# Altium project IIS.PrjPcb (part 1 of 3)
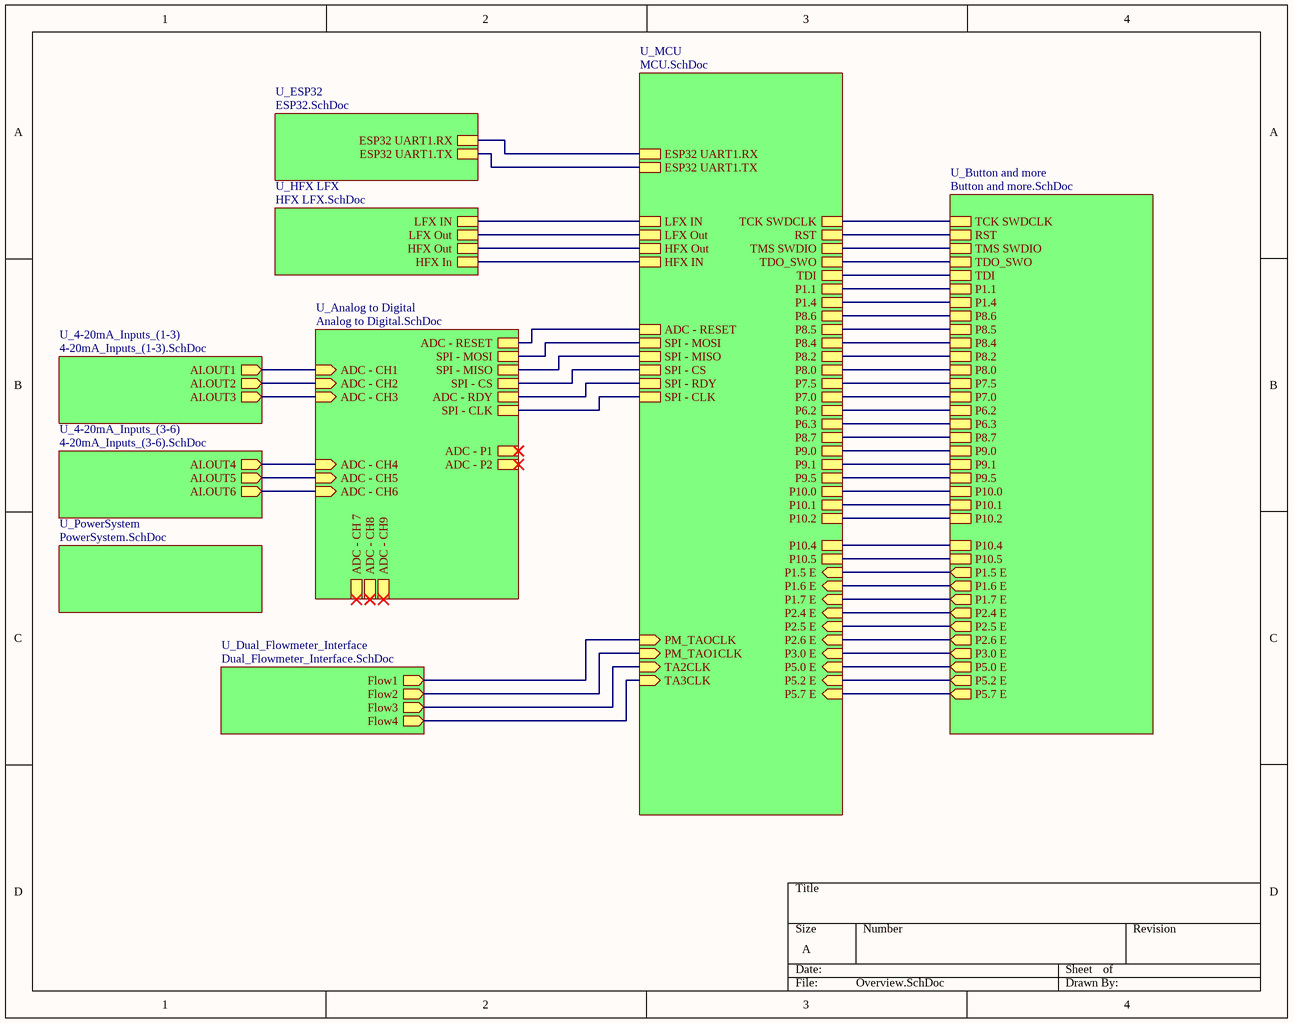
[diagram p0: Overview.SchDoc]
15 sheets, 216 parts. Net scope: hierarchical (ports join the sheet entries above them; power ports are global).
Board file: IIS_PCB.PcbDoc
Sheets:
  Overview.SchDoc
    U_MCU = MCU.SchDoc
    U_ESP32 = ESP32.SchDoc
    U_HFX LFX = HFX LFX.SchDoc
    U_Analog to Digital = Analog to Digital.SchDoc
    U_4-20mA_Inputs_(1-3) = 4-20mA_Inputs_(1-3).SchDoc
      U_4-20mA = 4-20mA.SchDoc
      U_4-20mA = 4-20mA.SchDoc
      U_4-20mA = 4-20mA.SchDoc
    U_4-20mA_Inputs_(3-6) = 4-20mA_Inputs_(3-6).SchDoc
      U_4-20mA = 4-20mA.SchDoc
      U_4-20mA = 4-20mA.SchDoc
      U_4-20mA = 4-20mA.SchDoc
    U_PowerSystem = PowerSystem.SchDoc
      U_5V_DCDC_Conv = 5V_DCDC_Conv.SchDoc
      U_3.3V_Regulator = 3.3V_Regulator.SchDoc
      U_24V_DCDC_Conv = 24V_DCDC_Conv.SchDoc
    U_Dual_Flowmeter_Interface = Dual_Flowmeter_Interface.SchDoc
      U_Dual_Flowmeter = Dual_Flowmeter.SchDoc
      U_Dual_Flowmeter = Dual_Flowmeter.SchDoc
    U_Button and more = Button and more.SchDoc

## Sheet Overview.SchDoc
size A; SheetNumber: 1; SheetTotal: 15

### Sub-sheets
U_4-20mA_Inputs_(1-3) = 4-20mA_Inputs_(1-3).SchDoc: AI.OUT1 (out), AI.OUT2 (out), AI.OUT3 (out)
U_4-20mA_Inputs_(3-6) = 4-20mA_Inputs_(3-6).SchDoc: AI.OUT4 (out), AI.OUT5 (out), AI.OUT6 (out)
U_Analog to Digital = Analog to Digital.SchDoc: ADC - RESET, SPI - MOSI, SPI - MISO, SPI - CS, ADC - CH1 (in), ADC - CH2 (in), ADC - CH3 (in), ADC - CH4 (in), ADC - CH5 (in), ADC - CH6 (in), ADC - CH 7, ADC - CH8, ADC - CH9, ADC - P1, ADC - P2, ADC - RDY, SPI - CLK
U_Button and more = Button and more.SchDoc: P10.5, P10.4, P10.2, P10.1, P10.0, P9.5, P9.1, P9.0, P8.7, P8.6, P8.5, P8.4, P8.2, P8.0, P7.5, P7.0, P6.2, P6.3, TDO_SWO, TDI, TCK SWDCLK, TMS SWDIO, RST, P1.4, P1.1, P1.5 E (out), P2.6 E (out), P2.4 E (out), P2.5 E (out), P3.0 E (out), P1.6 E (out), P1.7 E (out), P5.0 E (out), P5.2 E (out), P5.7 E (out)
U_Dual_Flowmeter_Interface = Dual_Flowmeter_Interface.SchDoc: Flow1 (out), Flow2 (out), Flow3 (out), Flow4 (out)
U_ESP32 = ESP32.SchDoc: ESP32 UART1.TX, ESP32 UART1.RX
U_HFX LFX = HFX LFX.SchDoc: HFX In, HFX Out, LFX Out, LFX IN
U_MCU = MCU.SchDoc: P1.1, TCK SWDCLK, HFX IN, LFX IN, P1.4, ESP32 UART1.RX, ESP32 UART1.TX, LFX Out, HFX Out, RST, TMS SWDIO, P10.5, P10.4, P10.2, P10.1, P10.0, P9.5, P9.1, P9.0, P8.7, P8.6, P8.5, P8.4, TA3CLK (in), P8.2, P8.0, P7.5, P7.0, TDO_SWO, P6.2, P6.3, TA2CLK (in), PM_TAOCLK (in), PM_TAO1CLK (in), P1.5 E (in), P2.6 E (in), P2.4 E (in), P2.5 E (in), P3.0 E (in), P5.7 E (in), P1.6 E (in), P1.7 E (in), P5.0 E (in), P5.2 E (in), TDI, SPI - CLK, SPI - MOSI, SPI - MISO, ADC - RESET, SPI - RDY, SPI - CS
U_PowerSystem = PowerSystem.SchDoc: no entries

### Nets
RST: sheet U_MCU/RST, sheet U_Button and more/RST
TMS_SWDIO: sheet U_MCU/TMS SWDIO, sheet U_Button and more/TMS SWDIO
NetCF3_U_4-20mA_Inputs_(1-3)_U_4-20mA#1_1: sheet U_Analog to Digital/ADC - CH1, sheet U_4-20mA_Inputs_(1-3)/AI.OUT1
NetCF3_U_4-20mA_Inputs_(1-3)_U_4-20mA#2_1: sheet U_Analog to Digital/ADC - CH2, sheet U_4-20mA_Inputs_(1-3)/AI.OUT2
NetCF3_U_4-20mA_Inputs_(1-3)_U_4-20mA#3_1: sheet U_Analog to Digital/ADC - CH3, sheet U_4-20mA_Inputs_(1-3)/AI.OUT3
NetCF3_U_4-20mA_Inputs_(3-6)_U_4-20mA#1_1: sheet U_Analog to Digital/ADC - CH4, sheet U_4-20mA_Inputs_(3-6)/AI.OUT4
NetCF3_U_4-20mA_Inputs_(3-6)_U_4-20mA#2_1: sheet U_Analog to Digital/ADC - CH5, sheet U_4-20mA_Inputs_(3-6)/AI.OUT5
NetCF3_U_4-20mA_Inputs_(3-6)_U_4-20mA#3_1: sheet U_Analog to Digital/ADC - CH6, sheet U_4-20mA_Inputs_(3-6)/AI.OUT6
NetCH1_2: sheet U_MCU/HFX Out, sheet U_HFX LFX/HFX Out
NetCH2_2: sheet U_MCU/HFX IN, sheet U_HFX LFX/HFX In
NetCL1_2: sheet U_MCU/LFX IN, sheet U_HFX LFX/LFX IN
NetCL2_2: sheet U_MCU/LFX Out, sheet U_HFX LFX/LFX Out
NetJEPD1_11: sheet U_MCU/P2.6 E, sheet U_Button and more/P2.6 E
NetJEPD1_13: sheet U_MCU/P3.0 E, sheet U_Button and more/P3.0 E
NetJEPD1_15: sheet U_MCU/P5.7 E, sheet U_Button and more/P5.7 E
NetJEPD1_17: sheet U_MCU/P5.2 E, sheet U_Button and more/P5.2 E
NetJEPD1_19: sheet U_MCU/P5.0 E, sheet U_Button and more/P5.0 E
NetJEPD1_23: sheet U_MCU/P2.4 E, sheet U_Button and more/P2.4 E
NetJEPD1_25: sheet U_MCU/P2.5 E, sheet U_Button and more/P2.5 E
NetJEPD1_29: sheet U_MCU/P1.6 E, sheet U_Button and more/P1.6 E
NetJEPD1_31: sheet U_MCU/P1.5 E, sheet U_Button and more/P1.5 E
NetJEPD1_33: sheet U_MCU/P1.7 E, sheet U_Button and more/P1.7 E
NetJEPD1_34: sheet U_MCU/TDI, sheet U_Button and more/TDI
NetJEPD1_36: sheet U_MCU/TDO_SWO, sheet U_Button and more/TDO_SWO
NetJEPD1_38: sheet U_MCU/TCK SWDCLK, sheet U_Button and more/TCK SWDCLK
NetR17_U_Dual_Flowmeter_Interface_U_Dual_Flowmeter#1_2: sheet U_MCU/TA2CLK, sheet U_Dual_Flowmeter_Interface/Flow3
NetR17_U_Dual_Flowmeter_Interface_U_Dual_Flowmeter#2_2: sheet U_MCU/PM_TAOCLK, sheet U_Dual_Flowmeter_Interface/Flow1
NetR27_U_Dual_Flowmeter_Interface_U_Dual_Flowmeter#1_1: sheet U_MCU/TA3CLK, sheet U_Dual_Flowmeter_Interface/Flow4
NetR27_U_Dual_Flowmeter_Interface_U_Dual_Flowmeter#2_1: sheet U_MCU/PM_TAO1CLK, sheet U_Dual_Flowmeter_Interface/Flow2
NetSW2_a: sheet U_MCU/P1.4, sheet U_Button and more/P1.4
NetSW3_a: sheet U_MCU/P1.1, sheet U_Button and more/P1.1
NetU1_1: sheet U_MCU/P10.1, sheet U_Button and more/P10.1
NetU1_2: sheet U_MCU/P10.2, sheet U_Button and more/P10.2
NetU1_17: sheet U_MCU/SPI - CLK, sheet U_Analog to Digital/SPI - CLK
NetU1_18: sheet U_MCU/SPI - MOSI, sheet U_Analog to Digital/SPI - MOSI
NetU1_19: sheet U_MCU/SPI - MISO, sheet U_Analog to Digital/SPI - MISO
NetU1_24: sheet U_MCU/P10.4, sheet U_Button and more/P10.4
NetU1_25: sheet U_MCU/P10.5, sheet U_Button and more/P10.5
NetU1_27: sheet U_MCU/P7.5, sheet U_Button and more/P7.5
NetU1_30: sheet U_MCU/P8.0, sheet U_Button and more/P8.0
NetU1_46: sheet U_MCU/P8.2, sheet U_Button and more/P8.2
NetU1_48: sheet U_MCU/P8.4, sheet U_Button and more/P8.4
NetU1_49: sheet U_MCU/P8.5, sheet U_Button and more/P8.5
NetU1_50: sheet U_MCU/P8.6, sheet U_Button and more/P8.6
NetU1_51: sheet U_MCU/P8.7, sheet U_Button and more/P8.7
NetU1_52: sheet U_MCU/P9.0, sheet U_Button and more/P9.0
NetU1_53: sheet U_MCU/P9.1, sheet U_Button and more/P9.1
NetU1_61: sheet U_MCU/SPI - RDY, sheet U_Analog to Digital/ADC - RDY
NetU1_62: sheet U_MCU/SPI - CS, sheet U_Analog to Digital/SPI - CS
NetU1_63: sheet U_MCU/ADC - RESET, sheet U_Analog to Digital/ADC - RESET
NetU1_76: sheet U_MCU/P6.2, sheet U_Button and more/P6.2
NetU1_77: sheet U_MCU/P6.3, sheet U_Button and more/P6.3
NetU1_88: sheet U_MCU/P7.0, sheet U_Button and more/P7.0
NetU1_97: sheet U_MCU/P9.5, sheet U_Button and more/P9.5
NetU1_98: sheet U_MCU/ESP32 UART1.RX, sheet U_ESP32/ESP32 UART1.RX
NetU1_99: sheet U_MCU/ESP32 UART1.TX, sheet U_ESP32/ESP32 UART1.TX
NetU1_100: sheet U_MCU/P10.0, sheet U_Button and more/P10.0

## Sheet MCU.SchDoc
size A; SheetNumber: 2; SheetTotal: 15
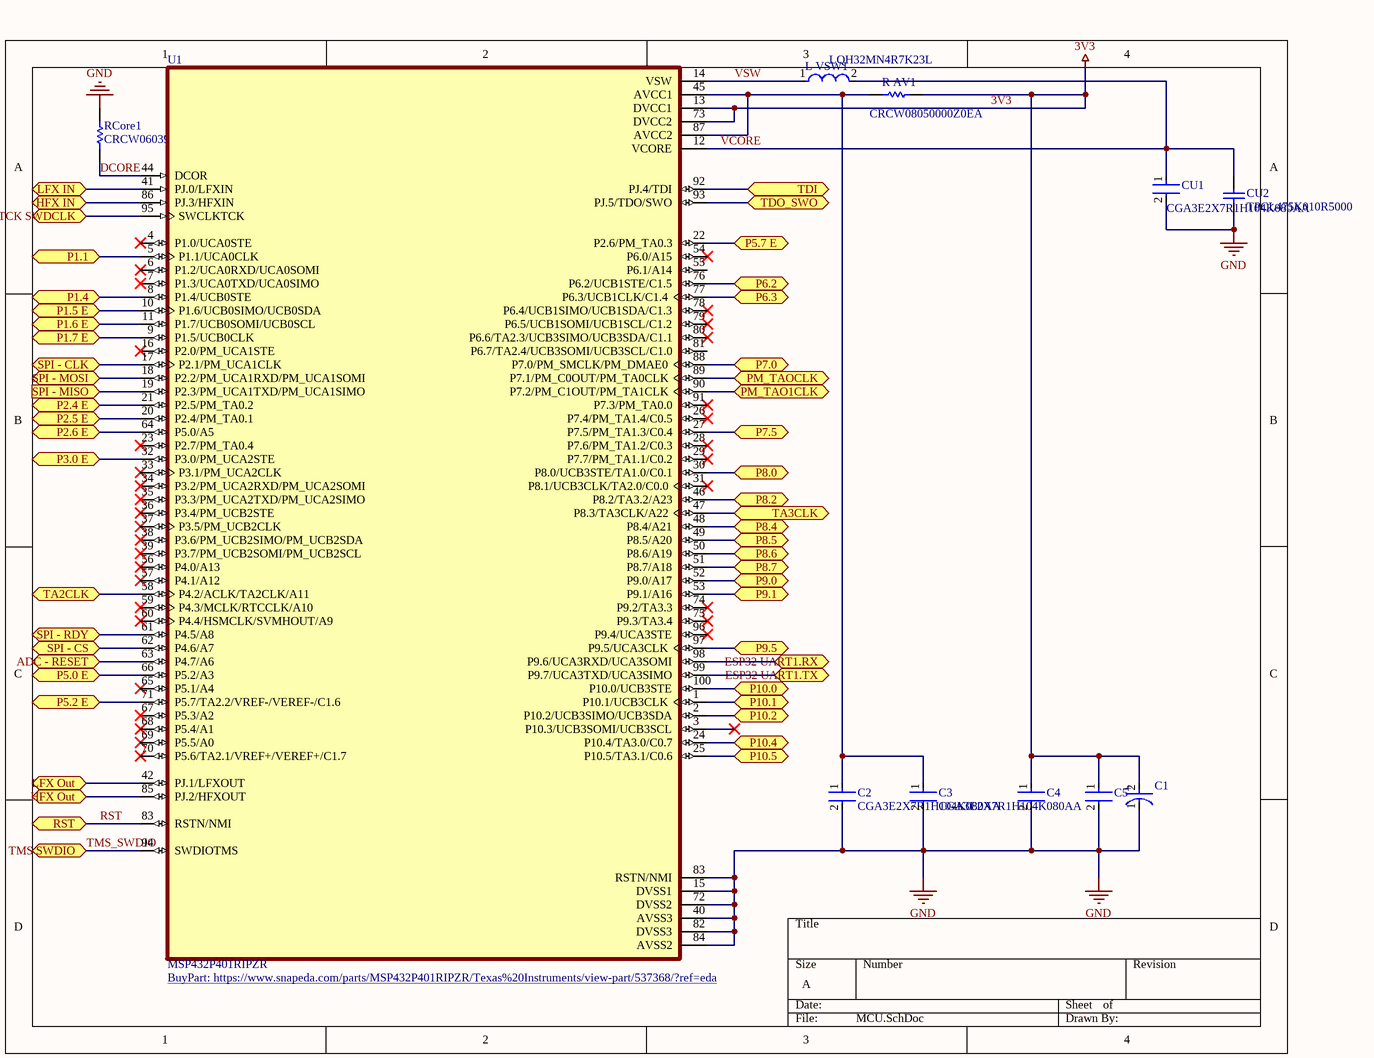
[diagram p1: MCU.SchDoc]

### Parts
C1  T520A106M010ATE080  [FP-T520A106M010ATE080-MFG]  (value not drawn)
C2  CGA3E2X7R1H104K080AA  [FP-CGA3E-0_3-0_1-IPC_A]
C3  CGA3E2X7R1H104K080AA  [FP-CGA3E-0_3-0_1-IPC_A]
C4  CGA3E2X7R1H104K080AA  [FP-CGA3E-0_3-0_1-IPC_A]  (value not drawn)
C5  CGA3E2X7R1H104K080AA  [FP-CGA3E-0_3-0_1-IPC_A]  (value not drawn)
CU1  CGA3E2X7R1H104K080AA  [FP-CGA3E-0_3-0_1-IPC_A]
CU2  TPCL475K010R5000  [CAPC1609X100X15LL20]
L_VSW1  LQH32MN4R7K23L  [FP-LQH32CH_23-MFG]
R_AV1  CRCW08050000Z0EA  [RESC2013X50X30LL20T20]
RCore1  CRCW060391K0FKEA  [RESC1609X50X30NL10T20]
U1  MSP432P401RIPZR  [QFP50P1600X1600X160-100N]

### Ports
ADC - RESET (bidir), ESP32 UART1.RX (bidir), ESP32 UART1.TX (bidir), HFX IN (bidir), HFX Out (bidir), LFX IN (bidir), LFX Out (bidir), P1.1 (bidir), P1.4 (bidir), P1.5 E (bidir), P1.6 E (bidir), P1.7 E (bidir), P2.4 E (bidir), P2.5 E (bidir), P2.6 E (bidir), P3.0 E (bidir), P5.0 E (bidir), P5.2 E (bidir), P5.7 E (bidir), P6.2 (bidir), P6.3 (bidir), P7.0 (bidir), P7.5 (bidir), P8.0 (bidir), P8.2 (bidir), P8.4 (bidir), P8.5 (bidir), P8.6 (bidir), P8.7 (bidir), P9.0 (bidir), P9.1 (bidir), P9.5 (bidir), P10.0 (bidir), P10.1 (bidir), P10.2 (bidir), P10.4 (bidir), P10.5 (bidir), PM_TAO1CLK (bidir), PM_TAOCLK (bidir), RST (bidir), SPI - CLK (bidir), SPI - CS (bidir), SPI - MISO (in), SPI - MOSI (bidir), SPI - RDY (bidir), TA2CLK (bidir), TA3CLK (bidir), TCK SWDCLK (bidir), TDI (bidir), TDO_SWO (bidir), TMS SWDIO (bidir)

### Nets
3V3: C1.2(A) C4.1 C5.1 R_AV1.2 U1.13(DVCC1) U1.73(DVCC2)
GND: C1.1(C) C2.2 C3.2 C4.2 C5.2 CU1.2 CU2.1 RCore1.1 U1.15(DVSS1) U1.40(AVSS3) U1.72(DVSS2) U1.82(DVSS3) U1.83(RSTN/NMI) U1.84(AVSS2)
\: U1.3(P10.3/UCB3SOMI/UCB3SCL)
DCORE: RCore1.2 U1.44(DCOR)
RST: U1.83(RSTN/NMI) ; port RST
TMS_SWDIO: U1.94(SWDIOTMS) ; port TMS SWDIO
VCORE: CU1.1 CU2.2 L_VSW1.2 U1.12(VCORE)
VSW: L_VSW1.1 U1.14(VSW)
NetC2_1: C2.1 C3.1 R_AV1.1 U1.45(AVCC1) U1.87(AVCC2)
NetCH1_2: U1.85(PJ.2/HFXOUT) ; port HFX Out
NetCH2_2: U1.86(PJ.3/HFXIN) ; port HFX IN
NetCL1_2: U1.41(PJ.0/LFXIN) ; port LFX IN
NetCL2_2: U1.42(PJ.1/LFXOUT) ; port LFX Out
NetJEPD1_11: U1.64(P5.0/A5) ; port P2.6 E
NetJEPD1_13: U1.32(P3.0/PM_UCA2STE) ; port P3.0 E
NetJEPD1_15: U1.22(P2.6/PM_TA0.3) ; port P5.7 E
NetJEPD1_17: U1.71(P5.7/TA2.2/VREF-/VEREF-/C1.6) ; port P5.2 E
NetJEPD1_19: U1.66(P5.2/A3) ; port P5.0 E
NetJEPD1_23: U1.21(P2.5/PM_TA0.2) ; port P2.4 E
NetJEPD1_25: U1.20(P2.4/PM_TA0.1) ; port P2.5 E
NetJEPD1_29: U1.11(P1.7/UCB0SOMI/UCB0SCL) ; port P1.6 E
NetJEPD1_31: U1.10(P1.6/UCB0SIMO/UCB0SDA) ; port P1.5 E
NetJEPD1_33: U1.9(P1.5/UCB0CLK) ; port P1.7 E
NetJEPD1_34: U1.92(PJ.4/TDI) ; port TDI
NetJEPD1_36: U1.93(PJ.5/TDO/SWO) ; port TDO_SWO
NetJEPD1_38: U1.95(SWCLKTCK) ; port TCK SWDCLK
NetR17_U_Dual_Flowmeter_Interface_U_Dual_Flowmeter#1_2: U1.58(P4.2/ACLK/TA2CLK/A11) ; port TA2CLK
NetR17_U_Dual_Flowmeter_Interface_U_Dual_Flowmeter#2_2: U1.89(P7.1/PM_C0OUT/PM_TA0CLK) ; port PM_TAOCLK
NetR27_U_Dual_Flowmeter_Interface_U_Dual_Flowmeter#1_1: U1.47(P8.3/TA3CLK/A22) ; port TA3CLK
NetR27_U_Dual_Flowmeter_Interface_U_Dual_Flowmeter#2_1: U1.90(P7.2/PM_C1OUT/PM_TA1CLK) ; port PM_TAO1CLK
NetSW2_a: U1.8(P1.4/UCB0STE) ; port P1.4
NetSW3_a: U1.5(P1.1/UCA0CLK) ; port P1.1
NetU1_1: U1.1(P10.1/UCB3CLK) ; port P10.1
NetU1_2: U1.2(P10.2/UCB3SIMO/UCB3SDA) ; port P10.2
NetU1_17: U1.17(P2.1/PM_UCA1CLK) ; port SPI - CLK
NetU1_18: U1.18(P2.2/PM_UCA1RXD/PM_UCA1SOMI) ; port SPI - MOSI
NetU1_19: U1.19(P2.3/PM_UCA1TXD/PM_UCA1SIMO) ; port SPI - MISO
NetU1_24: U1.24(P10.4/TA3.0/C0.7) ; port P10.4
NetU1_25: U1.25(P10.5/TA3.1/C0.6) ; port P10.5
NetU1_27: U1.27(P7.5/PM_TA1.3/C0.4) ; port P7.5
NetU1_30: U1.30(P8.0/UCB3STE/TA1.0/C0.1) ; port P8.0
NetU1_46: U1.46(P8.2/TA3.2/A23) ; port P8.2
NetU1_48: U1.48(P8.4/A21) ; port P8.4
NetU1_49: U1.49(P8.5/A20) ; port P8.5
NetU1_50: U1.50(P8.6/A19) ; port P8.6
NetU1_51: U1.51(P8.7/A18) ; port P8.7
NetU1_52: U1.52(P9.0/A17) ; port P9.0
NetU1_53: U1.53(P9.1/A16) ; port P9.1
NetU1_61: U1.61(P4.5/A8) ; port SPI - RDY
NetU1_62: U1.62(P4.6/A7) ; port SPI - CS
NetU1_63: U1.63(P4.7/A6) ; port ADC - RESET
NetU1_76: U1.76(P6.2/UCB1STE/C1.5) ; port P6.2
NetU1_77: U1.77(P6.3/UCB1CLK/C1.4) ; port P6.3
NetU1_88: U1.88(P7.0/PM_SMCLK/PM_DMAE0) ; port P7.0
NetU1_97: U1.97(P9.5/UCA3CLK) ; port P9.5
NetU1_98: U1.98(P9.6/UCA3RXD/UCA3SOMI) ; port ESP32 UART1.RX
NetU1_99: U1.99(P9.7/UCA3TXD/UCA3SIMO) ; port ESP32 UART1.TX
NetU1_100: U1.100(P10.0/UCB3STE) ; port P10.0

Not connected (* = marked no-connect by the designer): U1 4(P1.0/UCA0STE)* 6(P1.2/UCA0RXD/UCA0SOMI)* 7(P1.3/UCA0TXD/UCA0SIMO)* 16(P2.0/PM_UCA1STE)* 23(P2.7/PM_TA0.4)* 26(P7.4/PM_TA1.4/C0.5)* 28(P7.6/PM_TA1.2/C0.3)* 29(P7.7/PM_TA1.1/C0.2)* 31(P8.1/UCB3CLK/TA2.0/C0.0)* 33(P3.1/PM_UCA2CLK)* 34(P3.2/PM_UCA2RXD/PM_UCA2SOMI)* 35(P3.3/PM_UCA2TXD/PM_UCA2SIMO)* 36(P3.4/PM_UCB2STE)* 37(P3.5/PM_UCB2CLK)* 38(P3.6/PM_UCB2SIMO/PM_UCB2SDA)* 39(P3.7/PM_UCB2SOMI/PM_UCB2SCL)* 54(P6.0/A15)* 55(P6.1/A14) 56(P4.0/A13)* 57(P4.1/A12)* 59(P4.3/MCLK/RTCCLK/A10)* 60(P4.4/HSMCLK/SVMHOUT/A9)* 65(P5.1/A4)* 67(P5.3/A2)* 68(P5.4/A1)* 69(P5.5/A0)* 70(P5.6/TA2.1/VREF+/VEREF+/C1.7)* 74(P9.2/TA3.3)* 75(P9.3/TA3.4)* 78(P6.4/UCB1SIMO/UCB1SDA/C1.3)* 79(P6.5/UCB1SOMI/UCB1SCL/C1.2)* 80(P6.6/TA2.3/UCB3SIMO/UCB3SDA/C1.1)* 81(P6.7/TA2.4/UCB3SOMI/UCB3SCL/C1.0) 91(P7.3/PM_TA0.0)* 96(P9.4/UCA3STE)*

### Notes on the sheet
- (in symbol CMP-03017-000030-1) +

### Library data of the parts
C1 = CMP-03017-000030-1: CAP TANT POLY 10UF 10V 1206; Tolerance: 20%; Dielectric Material: Tantalum; Dissipation Factor: 8%; Leakage Current: 10uA; Life (Hours): 2000Hour; ESR (Equivalent Series Resistance): 80mR; Polarity: Polar; Length: 3.2mm; Construction: Flat; Features: General Purpose; Voltage Rating: 10V; Capacitance: 10uF; Width: 1.6mm; Mount: Surface Mount; Packaging: Tape and Reel; Voltage Rating (DC): 10V; Max Operating Temperature: 105°C; Case Code (Metric): 3216; Package Quantity: 1; Height: 1.6mm; Voltage: 10V; Depth: 1.6mm; Height - Seated (Max): 0.071inch; Radiation Hardening: No; Case/Package: 1206; Termination: SMD/SMT; Case Code (Imperial): 1206; Series: KO-CAP T520; REACH SVHC: No SVHC; RoHS Compliant: Yes; Min Operating Temperature: -55°C; Lead Free: Lead Free
C2-C5 CU1 = CMP-2000-07546-2: Cap Ceramic 100nF 50V X7R 10% Pad SMD 0603 +125°C Automotive T/R; Weight: 7.1E-05oz; Composition: Ceramic; Max Operating Temperature: 125°C; Termination: SMD/SMT; Dielectric: X7R; Length: 1.6mm; Package Quantity: 1; REACH SVHC: No SVHC; Lead Free: Lead Free; Case Code (Metric): 1608; Min Operating Temperature: -55°C; Packaging: Tape and Reel; Tolerance: 10%; Voltage Rating: 50V; Case Code (Imperial): 0603; Capacitance: 100nF; Case/Package: 0603; Voltage Rating (DC): 50V; Depth: 0.8mm; Radiation Hardening: No; Ratings: AEC-Q200; Mount: Surface Mount; Voltage: 50V; Thickness: 0.035inch; Width: 0.8mm; Height: 0.8mm
CU2 = CMP-2006-00210-1: Manufacturer: AVX Interconnect / Elco; Part Number: TPCL475K010R5000
L_VSW1 = CMP-06042-008286-2: Wire Wound Ferrite Inductor for General Circuits 4.7μH ±10% 1.2Ω 270mA 1210; Series Resistance: 1.2R; Test Frequency: 1MHz; Frequency: 31MHz; Shielding: Unshielded; Inductance: 4.7uH; Q Factor: 20; Case/Package: 1210; Min Operating Temperature: -25°C; Case Code (Metric): 3225; Height - Seated (Max): 0.087inch; Max DC Current: 270mA; Current Rating: 270mA; Case Code (Imperial): 1210; Tolerance: 10%; Length: 3.2mm; Width: 2.5mm; Number of Pins: 2; Weight: 0.000564oz; Packaging: Tape and Reel; Core Material: Ferrite; Height: 2mm; Termination: SMD/SMT; Self Resonant Frequency: 31MHz; DC Current: 270mA; Max Operating Temperature: 85°C; Radiation Hardening: No; Lead Free: Lead Free; Inductor Type: Wirewound; Rated Current-Max: 270mA; Mount: Surface Mount; Inductance Tolerance: 10%; Resistor Type: Wirewound; Military Standard: Not; Package Quantity: 1; REACH SVHC: No SVHC; Series: LQH32M; Depth: 2.7mm; DC Resistance (DCR): 1.2R
R_AV1 = CMP-2001-04896-1: Manufacturer: Vishay Dale; Part Number: CRCW08050000Z0EA
RCore1 = CMP-2000-03640-1: Manufacturer: Vishay Dale; Part Number: CRCW060391K0FKEA
U1 = MSP432P401RIPZR: SimpleLink ultra-low-power 32-bit Arm Cortex-M4F MCU With Precision ADC, 256KB Flash and 64KB RAM 100-LQFP -40 to 85; MF: Texas Instruments; Mouser-Purchase-URL: https://snapeda.com/shop?store=Mouser&id=537368; SnapEDA_Link: https://www.snapeda.com/parts/MSP432P401RIPZR/Texas%20Instruments/view-part/537368/?ref=snap; Digi-Key_Part_Number: 296-44715-1-ND; Texas_Instruments-Purchase-URL: https://snapeda.com/shop?store=Texas+Instruments&id=537368; Value: *; Package: LQFP-100 Texas Instruments; MP: MSP432P401RIPZR; DigiKey-Purchase-URL: https://snapeda.com/shop?store=DigiKey&id=537368; BuyPart: https://www.snapeda.com/parts/MSP432P401RIPZR/Texas%20Instruments/view-part/537368/?ref=eda

## Sheet ESP32.SchDoc
size A; SheetNumber: 5; SheetTotal: 16
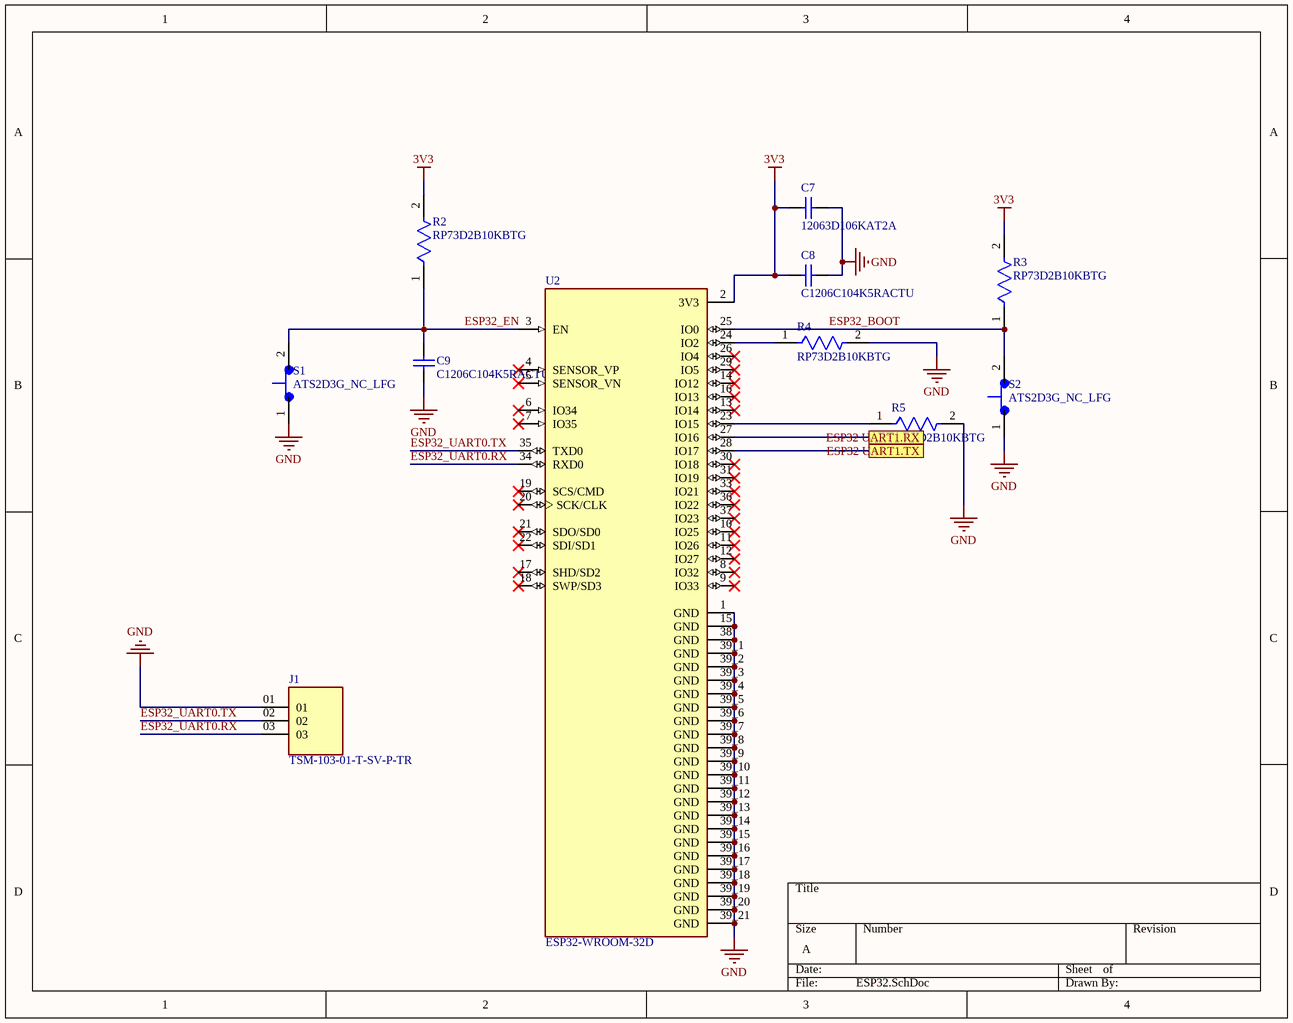
[diagram p2: ESP32.SchDoc]

### Parts
C7  12063D106KAT2A  [CAPC3216X229X50LL20T25]
C8  C1206C104K5RACTU  [KEMT-1206-2_M]
C9  C1206C104K5RACTU  [KEMT-1206-2_M]
J1  TSM-103-01-T-SV-P-TR  [SAMTEC_TSM-103-01-T-SV-P-TR]
R2  RP73D2B10KBTG  [FP-RP732B-MFG]
R3  RP73D2B10KBTG  [FP-RP732B-MFG]
R4  RP73D2B10KBTG  [FP-RP732B-MFG]
R5  RP73D2B10KBTG  [FP-RP732B-MFG]
S1  ATS2D3G_NC_LFG  [SW_ATS2D3G_NC_LFG]
S2  ATS2D3G_NC_LFG  [SW_ATS2D3G_NC_LFG]
U2  ESP32-WROOM-32D  [MODULE_ESP32-WROOM-32D]

### Ports
ESP32 UART1.RX, ESP32 UART1.TX

### Nets
3V3: C7.1 C8.1 R2.2 R3.2 U2.2(3V3)
GND: C7.2 C8.2 C9.1 J1.01 R4.2 R5.2 S1.1 S2.1 U2.1(GND) U2.15(GND) U2.38(GND) U2.39_1(GND) U2.39_2(GND) U2.39_3(GND) U2.39_4(GND) U2.39_5(GND) U2.39_6(GND) U2.39_7(GND) U2.39_8(GND) U2.39_9(GND) U2.39_10(GND) U2.39_11(GND) U2.39_12(GND) U2.39_13(GND) U2.39_14(GND) U2.39_15(GND) U2.39_16(GND) U2.39_17(GND) U2.39_18(GND) U2.39_19(GND) U2.39_20(GND) U2.39_21(GND)
ESP32_BOOT: R3.1 S2.2 U2.25(IO0)
ESP32_EN: C9.2 R2.1 S1.2 U2.3(EN)
ESP32_UART0.RX: J1.03 U2.34(RXD0)
ESP32_UART0.TX: J1.02 U2.35(TXD0)
NetR4_1: R4.1 U2.24(IO2)
NetR5_1: R5.1 U2.23(IO15)
NetU1_98: U2.27(IO16) ; port ESP32 UART1.RX
NetU1_99: U2.28(IO17) ; port ESP32 UART1.TX

Not connected (* = marked no-connect by the designer): U2 4(SENSOR_VP)* 5(SENSOR_VN)* 6(IO34)* 7(IO35)* 8(IO32)* 9(IO33)* 10(IO25)* 11(IO26)* 12(IO27)* 13(IO14)* 14(IO12)* 16(IO13)* 17(SHD/SD2)* 18(SWP/SD3)* 19(SCS/CMD)* 20(SCK/CLK)* 21(SDO/SD0)* 22(SDI/SD1)* 26(IO4)* 29(IO5)* 30(IO18)* 31(IO19)* 33(IO21)* 36(IO22)* 37(IO23)*

### Library data of the parts
C7 = CMP-2000-05863-1: Chip Capacitor, 10 uF, +/- 10%, 25 V, -55 to 85 degC, 1206 (3216 Metric), RoHS, Tape and Reel; Manufacturer: AVX; Rated Voltage: 25V; Dielectric: X5R; Capacitance: 10µF; Mounting Technology: SurfaceMount; Package Reference: 1206; Tolerance (%): ±10%; Manufacturer URL: http://www.avx.com/; Datasheet URL: http://datasheets.avx.com/cx5r.pdf; Package Description: 2-Pin Surface Mount Device, Body 3.2 x 1.6 mm; Datasheet Version: 05/2016; Case Size/Dimension: 1206
C8 C9 = CMP-1037-04202-2: CAP, Ceramic, 0.1 uF, +/- 10%, 50 V, -55 to 125 degC, 1206 (3216 Metric), RoHS, Tape and Reel; Manufacturer: Kemet; Voltage Rating: 50V; Capacitance: 0.1µF; Product Range: KEMET-CSeries; SVHC: ToBeAdvised; Dielectric Characteristic: X7R; Capacitor Case Style: 1206[3216Metric]; Package Reference: 1206-2; Package Description: 2-Leads SMD, Body 3.2 x 1.6 mm; Packaging: Tape&Reel; Operating Temperature Max: 125degC; Capacitance Tolerance: ±10%; Datasheet URL: https://datasheet.ciiva.com/6125/1725438-6125494.pdf; Manufacturer URL: http://www.kemet.com/; Operating Temperature Min: -55degC; Datasheet Version: Jul-13
J1 = TSM-103-01-T-SV-P-TR: MF: Samtec; Package: None; Availability: Unavailable; Value: *; MP: TSM-103-01-T-SV-P-TR; Price: None
R2-R5 = CMP-03211-008372-1: Res Thin Film 1206 10KΩ 0.1% 0.25W 15ppm/°C Molded SMD; Manufacturer: TE Connectivity; Voltage Rating: 200V; Temperature Range High: 155°C; packaging: 250 cut tape length; Composition: Thin Film; Category: Res; octopart_url: https://octopart.com/rp73d2b10kbtg-te+connectivity-42012630; ComponentLink2Description: Datasheet; Lead Free: Yes; Resistance: 10KΩ; Octopart: https://octopart.com/rp73d2b10kbtg-te+connectivity-42012630; Manufacturer Part Number: RP73D2B10KBTG; Temperature Coefficient: 15ppm/°C; Device Class L2: Resistors; Automotive: No; Ipc Land Pattern Name: RESC305155X55; Temperature: -55°C to 155°C; Device Class L1: Passive Components; Device Class L3: Chip SMD Resistors; Value: 10KΩ; Height: 0.65mm; Power Rating: 0.25W; Package: RP732B; Tolerance: 0.1%; Series: RP73; ComponentLink2URL: https://www.te.com/commerce/DocumentDelivery/DDEController?Action=showdoc&DocId=Data+Sheet%7F1773272%7FL%7Fpdf%7FEnglish%7FENG_DS_1773272_L.pdf%7F8-1879255-6; RoHS: TRUE; Temperature Range Low: -55°C
S1 S2 = ATS2D3G_NC_LFG: Tactile Switch SPST-NC Top Actuated Surface Mount; Package: None; Price: None; Value: *; MP: ATS2D3G_NC_LFG; Availability: Unavailable
U2 = ESP32-WROOM-32D: Bluetooth, WiFi 802.11b/g/n, Bluetooth v4.2 + EDR, Class 1, 2 and 3 Transceiver Module 2.4GHz ~ 2.5GHz Integrated, Trace Surface Mount; MF: Espressif Systems; Price: None; Package: Module Espressif Systems; Availability: Unavailable; SnapEDA_Link: https://www.snapeda.com/parts/ESP32-WROOM-32D/Espressif%20Systems/view-part/2768115/?ref=snap; Value: *; MP: ESP32-WROOM-32D

## Sheet HFX LFX.SchDoc
size A; SheetNumber: 4; SheetTotal: 15
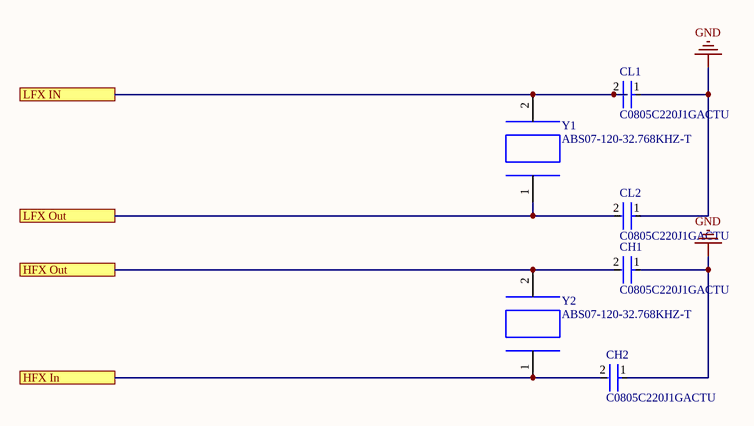
[diagram p3: HFX LFX.SchDoc]

### Parts
CH1  C0805C220J1GACTU  [FP-C0805C-DN-MFG]
CH2  C0805C220J1GACTU  [FP-C0805C-DN-MFG]
CL1  C0805C220J1GACTU  [FP-C0805C-DN-MFG]
CL2  C0805C220J1GACTU  [FP-C0805C-DN-MFG]
Y1  ABS07-120-32.768KHZ-T  [XTAL_ABS07-120-32.768KHZ-T]
Y2  ABS07-120-32.768KHZ-T  [XTAL_ABS07-120-32.768KHZ-T]

### Ports
HFX In, HFX Out, LFX IN, LFX Out

### Nets
GND: CH1.1 CH2.1 CL1.1 CL2.1
NetCH1_2: CH1.2 Y2.2 ; port HFX Out
NetCH2_2: CH2.2 Y2.1 ; port HFX In
NetCL1_2: CL1.2 Y1.2 ; port LFX IN
NetCL2_2: CL2.2 Y1.1 ; port LFX Out

### Library data of the parts
CH1 CH2 CL1 CL2 = CMP-2007-00448-2: CAP CER 22PF 100V 5% NP0 0805; Manufacturer: KEMET; Temperature Coefficient: 30ppm/°C; Tolerance: 0.05; Temperature Characteristic: C0G; Value: 22 pF; RoHS: TRUE; ComponentLink2URL: https://content.kemet.com/datasheets/KEM_C1003_C0G_SMD.pdf; Capacitance: 22 pF; Material: Ceramic; Mouser Description: Multilayer Ceramic Capacitor, C Series, 22 Pf, - 5%, C0g / Np0, 100 V, 0805 [2012 Metric] Rohs Compliant: Yes; Digikey Description: CAP CER 22PF 100V 5% NP0 0805; Octopart: https://octopart.com/c0805c220j1gactu-kemet-3791395; Device Class L3: Ceramic Capacitors; Device Class L2: Capacitors; Voltage Rating: 100 V; Temperature Range Low: -55°C; Ipc Land Pattern Name: CAPC200125X78; Lead Free: Yes; ComponentLink2Description: Datasheet; Manufacturer Part Number: C0805C220J1GACTU; Category: Cap; Temperature: -55°C to +125°C; Package: C0805C-DN; Device Class L1: Passive Components; Temperature Range High: +125°C; Height: 0.88mm; Automotive: No
Y1 Y2 = ABS07-120-32.768KHZ-T: 32.768kHz Â±20ppm Crystal 6pF 55 kOhms 2-SMD, No Lead; MF: Abracon; Value: *; SnapEDA_Link: https://www.snapeda.com/parts/ABS07-120-32.768KHZ-T/Abracon%20LLC/view-part/330478/?ref=snap; Package: SMD-2 Abracon LLC; MP: ABS07-120-32.768KHZ-T; Digi-Key_Purchase_URL: https://www.digikey.com/product-detail/en/abracon-llc/ABS07-120-32.768KHZ-T/535-11937-1-ND/3724046?utm_source=snapeda&utm_medium=aggregator&utm_campaign=symbol; Digi-Key_Part_Number: 535-11937-1-ND

## Sheet Analog to Digital.SchDoc
size A; SheetNumber: 6; SheetTotal: 15
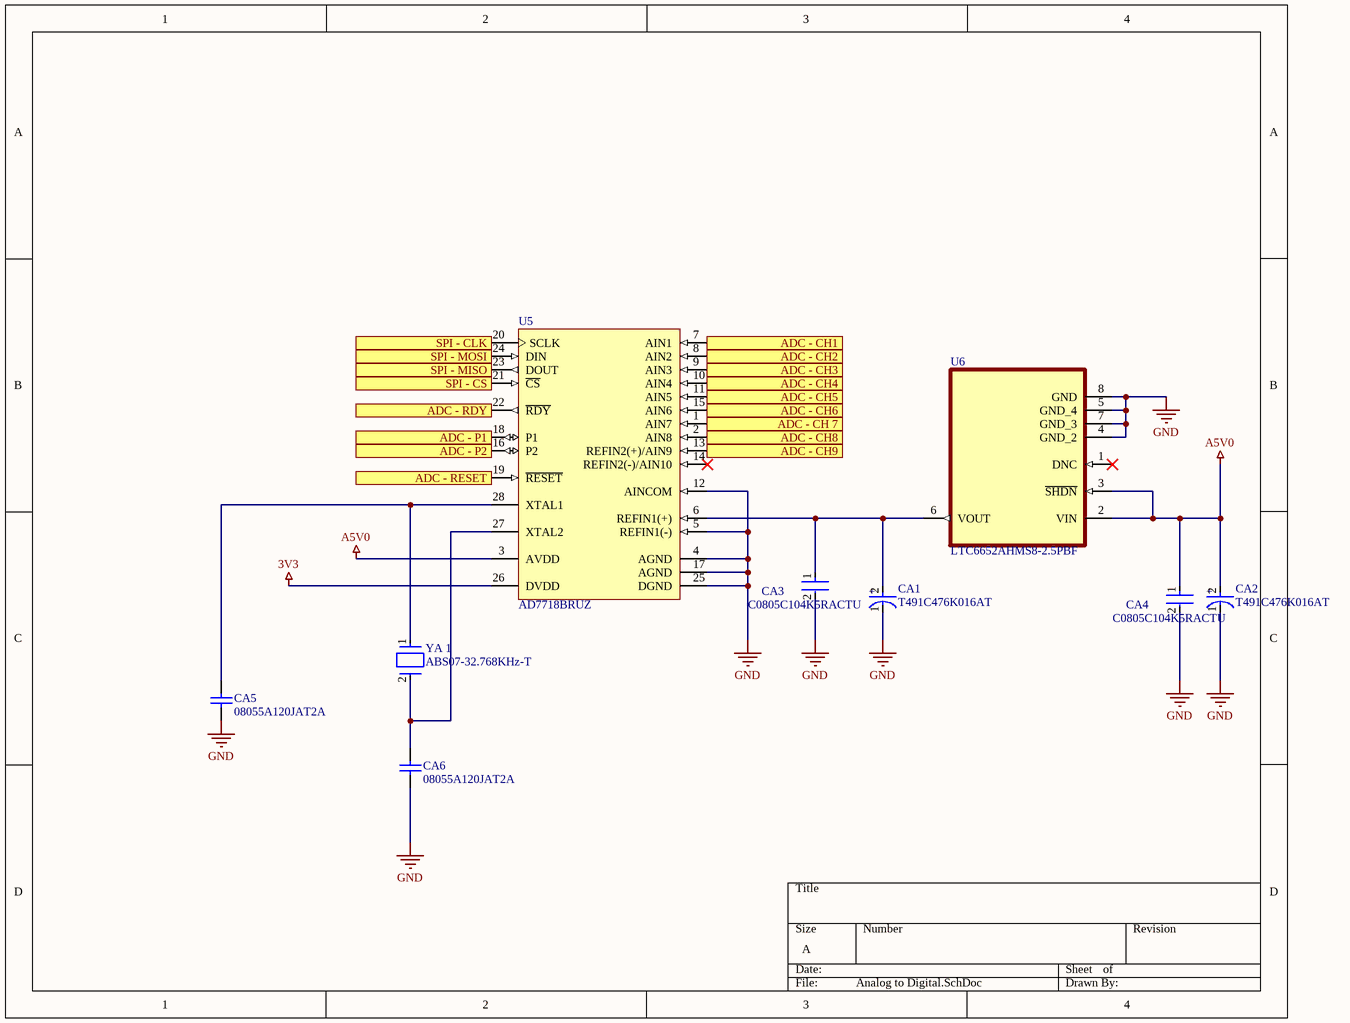
[diagram p4: Analog to Digital.SchDoc]

### Parts
CA1  T491C476K016AT  [FP-T491C476K016AT-MFG]
CA2  T491C476K016AT  [FP-T491C476K016AT-MFG]
CA3  C0805C104K5RACTU  [FP-C0805C-DN-MFG]
CA4  C0805C104K5RACTU  [FP-C0805C-DN-MFG]
CA5  08055A120JAT2A  [CAPC2013X71X50ML20T25]
CA6  08055A120JAT2A  [CAPC2013X71X50ML20T25]
U5  AD7718BRUZ  [RU-28_N]
U6  LTC6652AHMS8-2.5PBF  [SOP65P490X110-8N]
YA_1  ABS07-32.768KHz-T  [FP-ABS07-MFG]

### Ports
ADC - CH1 (in), ADC - CH2 (in), ADC - CH3 (in), ADC - CH4 (in), ADC - CH5 (in), ADC - CH6 (in), ADC - CH8 (in), ADC - CH9 (in), ADC - CH 7 (in), ADC - P1, ADC - P2, ADC - RDY, ADC - RESET, SPI - CLK, SPI - CS, SPI - MISO (out), SPI - MOSI (in)

### Nets
3V3: U5.26(DVDD)
A5V0: CA2.2(A) CA4.1 U5.3(AVDD) U6.2(VIN) U6.3(~{SHDN})
GND: CA1.1(C) CA2.1(C) CA3.2 CA4.2 CA5.1 CA6.1 U5.4(AGND) U5.5(REFIN1(-)) U5.12(AINCOM) U5.17(AGND) U5.25(DGND) U6.4(GND_2) U6.5(GND_4) U6.7(GND_3) U6.8(GND)
NetCA1_2: CA1.2(A) CA3.1 U5.6(REFIN1(+)) U6.6(VOUT)
NetCA5_2: CA5.2 U5.28(XTAL1) YA_1.1
NetCA6_2: CA6.2 U5.27(XTAL2) YA_1.2
NetCF3_U_4-20mA_Inputs_(1-3)_U_4-20mA#1_1: U5.7(AIN1) ; port ADC - CH1
NetCF3_U_4-20mA_Inputs_(1-3)_U_4-20mA#2_1: U5.8(AIN2) ; port ADC - CH2
NetCF3_U_4-20mA_Inputs_(1-3)_U_4-20mA#3_1: U5.9(AIN3) ; port ADC - CH3
NetCF3_U_4-20mA_Inputs_(3-6)_U_4-20mA#1_1: U5.10(AIN4) ; port ADC - CH4
NetCF3_U_4-20mA_Inputs_(3-6)_U_4-20mA#2_1: U5.11(AIN5) ; port ADC - CH5
NetCF3_U_4-20mA_Inputs_(3-6)_U_4-20mA#3_1: U5.15(AIN6) ; port ADC - CH6
NetU1_17: U5.20(SCLK) ; port SPI - CLK
NetU1_18: U5.24(DIN) ; port SPI - MOSI
NetU1_19: U5.23(DOUT) ; port SPI - MISO
NetU1_61: U5.22(~{RDY}) ; port ADC - RDY
NetU1_62: U5.21(~{CS}) ; port SPI - CS
NetU1_63: U5.19(~{RESET}) ; port ADC - RESET
NetU5_1: U5.1(AIN7) ; port ADC - CH 7
NetU5_2: U5.2(AIN8) ; port ADC - CH8
NetU5_13: U5.13(REFIN2(+)/AIN9) ; port ADC - CH9
NetU5_16: U5.16(P2) ; port ADC - P2
NetU5_18: U5.18(P1) ; port ADC - P1

Not connected (* = marked no-connect by the designer): U5 14(REFIN2(-)/AIN10)*; U6 1(DNC)*

### Notes on the sheet
- (in symbol CMP-03017-000042-1) +

### Library data of the parts
CA1 CA2 = CMP-03017-000042-1: CAP TANT 47UF 10% 16V 2312; Leakage Current: 7.5uA; Dielectric Material: Tantalum; Polarity: Polar; Dissipation Factor: 6%; Tolerance: 20%; ESR (Equivalent Series Resistance): 1.2R; Voltage: 6V; Ripple Current: 303mA; Life (Hours): 2000Hour; Min Operating Temperature: -55°C; Case/Package: Molded; Lead Free: Lead Free; Radiation Hardening: No; Voltage Rating: 16V; Failure Rate: 0.001%; Max Operating Temperature: 125°C; Features: General Purpose; Length: 6mm; REACH SVHC: No SVHC; Package Quantity: 1; Case Code (Metric): 6032; Mount: Surface Mount; Number of Pins: 2; Height: 2.5mm; Termination: SMD/SMT; RoHS Compliant: Yes; Width: 3.2mm; Case Code (Imperial): 2312; Voltage Rating (DC): 16V; Capacitance: 47uF; Depth: 3.2mm; Height - Seated (Max): 0.11inch; Packaging: Tape and Reel
CA3 CA4 = CMP-2007-00279-2: CAP CER 0.1UF 50V X7R 0805; Manufacturer: KEMET; Value: 0.10 μF; Tolerance: 0.1; Temperature Coefficient: 30ppm/°C; Manufacturer Part Number: C0805C104K5RACTU; Device Class L2: Capacitors; Temperature Range Low: -55°C; Voltage Rating: 50 V; Digikey Description: CAP CER 0.1UF 50V X7R 0805; Category: Cap; ComponentLink2Description: Datasheet; Octopart: https://octopart.com/c0805c104k5ractu-kemet-143926; RoHS: TRUE; ComponentLink2URL: https://content.kemet.com/datasheets/KEM_C1003_C0G_SMD.pdf; Temperature Characteristic: X7R; Temperature: -55°C to +125°C; Height: 0.88mm; Temperature Range High: +125°C; Device Class L1: Passive Components; Automotive: No; Lead Free: Yes; Ipc Land Pattern Name: CAPC200125X78; Material: Ceramic; Device Class L3: Ceramic Capacitors; Mouser Description: Cap Ceramic 0.1uF 50V X7R 10% SMD 2.0 x 1.2 mm 125 C Paper T/R; Capacitance: 0.10 μF; Package: C0805C-DN
CA5 CA6 = CMP-2007-04500-1: Manufacturer: AVX Interconnect / Elco; Part Number: 08055A120JAT2A
U5 = CMP-0313-02003-2: 10 Channel 24-Bit Low Power Sigma-Delta Analog-to-Digital Converter with Serial, SPI Interface, 1.365KSPS, -40 to +85 degC, RU-28, Pb-Free, Tube; Manufacturer: Analog Devices; Generic Part Number: AD7718; Interface: Ser, SPI; Resolution (Bits): 24; Channels: 10; Throughput Rate (SPS): 1.365K; PackageVersion: 2005; ComponentLink2URL: http://www.analog.com/static/imported-files/data_sheets/AD7708_7718.pdf; ComponentLink3Description: Package Specification; Packing: Tube; DatasheetVersion: Rev.0; Mounting Technology: Surface Mount; Code_JEDEC: MO-153-AE; ComponentLink3URL: http://www.analog.com/static/imported-files/packages/249854663RU_28.pdf; ComponentLink4Description: Product URL; ComponentLink1Description: Manufacturer URL; ComponentLink2Description: Datasheet; ComponentLink1URL: http://www.analog.com/en/index.html; ComponentLink4URL: http://www.analog.com/en/analog-to-digital-converters/ad-converters/ad7718/products/product.html; PackageReference: RU-28; PartNumber: AD7718BRUZ; RoHS: Y; PackageDescription: 28-Lead Thin Shrink Small Outline Package [TSSOP]
U6 = LTC6652AHMS8-2.5PBF: Ic Vref Series Prec 2.5v 8-Msop - Ltc6652ahms8-2.5#Pbf; MF: Linear Technology; Package: MSOP-8 Linear Technology; Price: None; Availability: Unavailable; MP: LTC6652AHMS8-2.5#PBF; SnapEDA_Link: https://www.snapeda.com/parts/LTC6652AHMS8-2.5%23PBF/Analog%20Devices/view-part/135303/?ref=snap; Value: *
YA_1 = CMP-0447-00001-3: CRYSTAL 32.7680KHZ 12.5PF SMD; Frequency Tolerance: 20ppm; Series Resistance: 70kR; Operating Frequency: 32.768 kHz; Number of Pins: 2; Package Quantity: 3000; Tolerance: 20ppm; Max Operating Temperature: 85°C; Width: 0.061inch; Frequency: 32.768kHz; Termination: SMD/SMT; Min Operating Temperature: -40°C; Radiation Hardening: No; Series: ABS07; Length: 3.2mm; Case/Package: CSMD; ESR (Equivalent Series Resistance): 70kR; RoHS Compliant: Yes; Load Capacitance: 12.5pF; Depth: 1.5mm; REACH SVHC: No SVHC; Height: 0.035inch; Packaging: Tape and Reel; Lead Free: Lead Free

## Sheet 4-20mA_Inputs_(1-3).SchDoc
size A; SheetNumber: 7; SheetTotal: 16
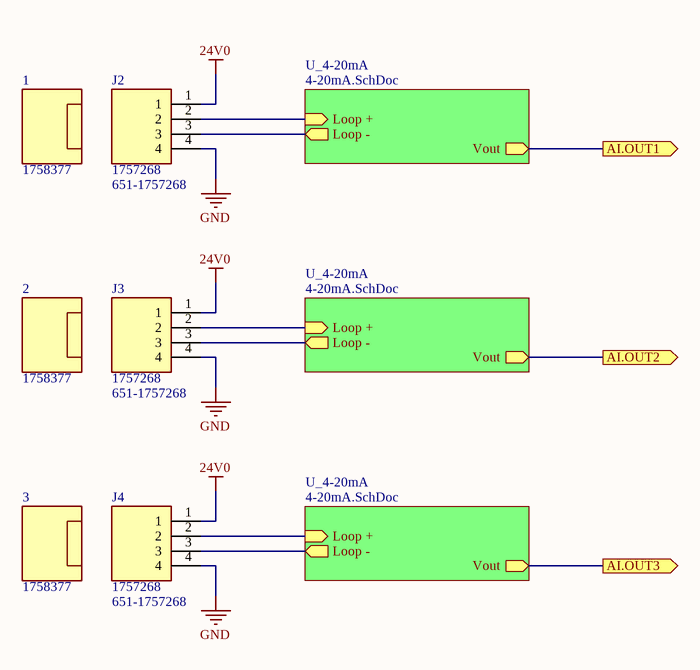
[diagram p5: 4-20mA_Inputs_(1-3).SchDoc]

### Parts
1  1758377  [Connector_1758377]
2  1758377  [Connector_1758377]
3  1758377  [Connector_1758377]
J2  1757268  Supplier Part Number 1: 651-1757268  [SHDRRA4W103P0X508_1X4_2232X1200X875P]
J3  1757268  Supplier Part Number 1: 651-1757268  [SHDRRA4W103P0X508_1X4_2232X1200X875P]
J4  1757268  Supplier Part Number 1: 651-1757268  [SHDRRA4W103P0X508_1X4_2232X1200X875P]

### Sub-sheets
U_4-20mA = 4-20mA.SchDoc: Loop + (in), Loop - (out), Vout (out)
U_4-20mA = 4-20mA.SchDoc: Loop + (in), Loop - (out), Vout (out)
U_4-20mA = 4-20mA.SchDoc: Loop + (in), Loop - (out), Vout (out)

### Ports
AI.OUT1 (out), AI.OUT2 (out), AI.OUT3 (out)

### Nets
24V0: J2.1 J3.1 J4.1
GND: J2.4 J3.4 J4.4
Net_U_1_U_4-20mA_Inputs_(1-3)_U_4-20mA#1_2: J2.3 ; sheet U_4-20mA/Loop -
Net_U_1_U_4-20mA_Inputs_(1-3)_U_4-20mA#2_2: J3.3 ; sheet U_4-20mA/Loop -
Net_U_1_U_4-20mA_Inputs_(1-3)_U_4-20mA#3_2: J4.3 ; sheet U_4-20mA/Loop -
NetCF3_U_4-20mA_Inputs_(1-3)_U_4-20mA#1_1: port AI.OUT1, sheet U_4-20mA/Vout
NetCF3_U_4-20mA_Inputs_(1-3)_U_4-20mA#2_1: port AI.OUT2, sheet U_4-20mA/Vout
NetCF3_U_4-20mA_Inputs_(1-3)_U_4-20mA#3_1: port AI.OUT3, sheet U_4-20mA/Vout
NetF1_U_4-20mA_Inputs_(1-3)_U_4-20mA#1_1: J2.2 ; sheet U_4-20mA/Loop +
NetF1_U_4-20mA_Inputs_(1-3)_U_4-20mA#2_1: J3.2 ; sheet U_4-20mA/Loop +
NetF1_U_4-20mA_Inputs_(1-3)_U_4-20mA#3_1: J4.2 ; sheet U_4-20mA/Loop +

### Library data of the parts
1-3 = 1758377: Plug, Terminal Block; 12 A; 250 V; 5.08 mm; 4 position, screw, Pre-Printed; Manufacturer: Phoenix Contact; Voltage Rating: 250V; Max Current Rating: 12A; Number of Positions Per Level: 4; Number of Levels: 1; Current: 15A; Voltage: 300V; Wire Gauge (Max): 30AWG; Wire Gauge (Min): 12AWG; Pitch: 5.08mm; Stripping Length: 7mm; Supplier 1: Digi-Key; Manufacturer Part Number: 1758377; RoHS: Yes; Category: Terminal Blocks; Pricing 1: 1=4.53000, 10=4.33400, 50=4.21580, 100=3.94000, 250=3.62484, 500=3.34900, 1000=3.19143, 2500=3.03380 (USD); Mount: Free Hanging; Color: Green; Contact Plating: Tin; Weight: 0.249387oz; Housing Color: Green; Housing Material: Plastic; Package Quantity: 50; Packaging: Bulk; Current Rating: 12A; Termination: Screw; Number of Positions: 4; Number of Contacts: 4; Number of Poles: 4; Connector Type: Screw; Series: COMBICON MSTB; Flammability Rating: UL94 V-0; ComponentLink1URL: https://datasheet.ciiva.com/795/1758377-795513.pdf?src-supplier=Digi-Key; ComponentLink1Description: https://datasheet.ciiva.com/795/1758377-795513.pdf?src-supplier=Digi-Key; ComponentLink2URL: https://datasheet.ciiva.com/16046/1758377-16046392.pdf?src-supplier=Onlinecomponents.com; ComponentLink2Description: https://datasheet.ciiva.com/16046/1758377-16046392.pdf?src-supplier=Onlinecomponents.com; ComponentLink3URL: https://datasheet.ciiva.com/29376/567557-da-01-de-steckerteil-1758377-50-st-29376878.pdf?src-supplier=Conrad; ComponentLink3Description: https://datasheet.ciiva.com/29376/567557-da-01-de-steckerteil-1758377-50-st-29376878.pdf?src-supplier=Conrad; ComponentLink4URL: https://datasheet.ciiva.com/14607/70055302-14607548.pdf?src-supplier=Allied+Electronics; ComponentLink4Description: https://datasheet.ciiva.com/14607/70055302-14607548.pdf?src-supplier=Allied+Electronics; ComponentLink5URL: https://datasheet.ciiva.com/33106/1758377-33106027.pdf?src-supplier=Today+Components; ComponentLink5Description: https://datasheet.ciiva.com/33106/1758377-33106027.pdf?src-supplier=Today+Components; Supplier Part Number 1: 277-1966-ND; Stock 1: 560
J2-J4 = 1757268: Connector; Manufacturer_Name: Phoenix Contact; Datasheet Link: https://datasheet.datasheetarchive.com/originals/distributors/SFDatasheet-2/sf-00051651.pdf; Height: 8.75mm; Manufacturer_Part_Number: 1757268; Mouser Part Number: 651-1757268; Mouser Price/Stock: https://www.mouser.co.uk/ProductDetail/Phoenix-Contact/1757268?qs=uD%2FdkN7XIa2BicmSj3mD7g%3D%3D; Arrow Part Number: 1757268; Arrow Price/Stock: https://www.arrow.com/en/products/1757268/phoenix-contact?region=nac; Supplier 1: Mouser

## Sheet 4-20mA.SchDoc
size A; SheetNumber: 8; SheetTotal: 15
Used 6 times, as channels U_4-20mA_Inputs_(1-3)/U_4-20mA, U_4-20mA_Inputs_(1-3)/U_4-20mA, U_4-20mA_Inputs_(1-3)/U_4-20mA, U_4-20mA_Inputs_(3-6)/U_4-20mA, U_4-20mA_Inputs_(3-6)/U_4-20mA, U_4-20mA_Inputs_(3-6)/U_4-20mA. Parts and nets are listed once, with the designators drawn on the sheet.
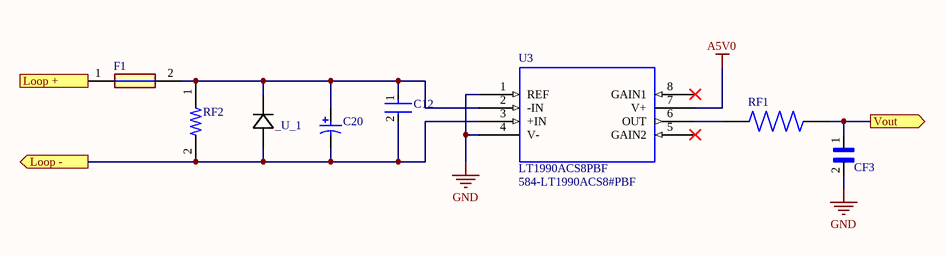
[diagram p6: 4-20mA.SchDoc]

### Parts
_U_1  1KSMB39CA  [1KSMBSeries_LTF]  (value not drawn)
C12  C0603C104K5RACTU  [FP-C0603C-CF-IPC_A]  (value not drawn)
C20  UUD1V4R7MCL1GS  [NIC-CAPA2-4X5.8_V]  (value not drawn)
CF3  GCM188R71C105KA64J  [CAPC1608X90N]  (value not drawn)
F1  0ZCJ0005FF2E  [FUSC3216X85N]  (value not drawn)
RF1  CRS2010AFX-1001ELF  [RESC5025X70N]  (value not drawn)
RF2  CRGS0805J100R  [RESC2012X65N]  (value not drawn)
U3  LT1990ACS8PBF  Supplier Part Number 1: 584-LT1990ACS8#PBF  [SO-8_S]

### Ports
Loop + (in), Loop - (out), Vout (out)

### Nets
A5V0: U3.7(V+)
GND: CF3.2 U3.1(REF) U3.4(V-)
Loop +: F1.1 ; port Loop +
Loop -: _U_1.2 C12.2 C20.2 RF2.2 U3.3(+IN) ; port Loop -
Vout: CF3.1 RF1.2 ; port Vout
Net_U_1_1: _U_1.1 C12.1 C20.1 F1.2 RF2.1 U3.2(-IN)
NetRF1_1: RF1.1 U3.6(OUT)

Not connected (* = marked no-connect by the designer): U3 5(GAIN2)* 8(GAIN1)*

### Channels
U_4-20mA_Inputs_(1-3)/U_4-20mA: designators end in _U_4-20mA_Inputs_(1-3)_U_4-20mA#1; ports Loop +=NetF1_U_4-20mA_Inputs_(1-3)_U_4-20mA#1_1 Loop -=Net_U_1_U_4-20mA_Inputs_(1-3)_U_4-20mA#1_2 Vout=NetCF3_U_4-20mA_Inputs_(1-3)_U_4-20mA#1_1
U_4-20mA_Inputs_(1-3)/U_4-20mA: designators end in _U_4-20mA_Inputs_(1-3)_U_4-20mA#2; ports Loop +=NetF1_U_4-20mA_Inputs_(1-3)_U_4-20mA#2_1 Loop -=Net_U_1_U_4-20mA_Inputs_(1-3)_U_4-20mA#2_2 Vout=NetCF3_U_4-20mA_Inputs_(1-3)_U_4-20mA#2_1
U_4-20mA_Inputs_(1-3)/U_4-20mA: designators end in _U_4-20mA_Inputs_(1-3)_U_4-20mA#3; ports Loop +=NetF1_U_4-20mA_Inputs_(1-3)_U_4-20mA#3_1 Loop -=Net_U_1_U_4-20mA_Inputs_(1-3)_U_4-20mA#3_2 Vout=NetCF3_U_4-20mA_Inputs_(1-3)_U_4-20mA#3_1
U_4-20mA_Inputs_(3-6)/U_4-20mA: designators end in _U_4-20mA_Inputs_(3-6)_U_4-20mA#1; ports Loop +=NetF1_U_4-20mA_Inputs_(3-6)_U_4-20mA#1_1 Loop -=Net_U_1_U_4-20mA_Inputs_(3-6)_U_4-20mA#1_2 Vout=NetCF3_U_4-20mA_Inputs_(3-6)_U_4-20mA#1_1
U_4-20mA_Inputs_(3-6)/U_4-20mA: designators end in _U_4-20mA_Inputs_(3-6)_U_4-20mA#2; ports Loop +=NetF1_U_4-20mA_Inputs_(3-6)_U_4-20mA#2_1 Loop -=Net_U_1_U_4-20mA_Inputs_(3-6)_U_4-20mA#2_2 Vout=NetCF3_U_4-20mA_Inputs_(3-6)_U_4-20mA#2_1
U_4-20mA_Inputs_(3-6)/U_4-20mA: designators end in _U_4-20mA_Inputs_(3-6)_U_4-20mA#3; ports Loop +=NetF1_U_4-20mA_Inputs_(3-6)_U_4-20mA#3_1 Loop -=Net_U_1_U_4-20mA_Inputs_(3-6)_U_4-20mA#3_2 Vout=NetCF3_U_4-20mA_Inputs_(3-6)_U_4-20mA#3_1

### Library data of the parts
_U_1 = 1KSMB39CA: No Description Available; Mfr_Name: Littelfuse Inc; Copyright: Copyright (C) 2021 Ultra Librarian. All rights reserved.; Manufacturer_Part_Number: 1KSMB39CA; Digi-Key_Part_Number_1: 1KSMB39CA-ND; Digi-Key_Part_Number_2: F11451CT-ND; Digi-Key_Part_Number_3: F11451DKR-ND; Digi-Key_Part_Number_4: F11451TR-ND; RefDes: RefDes; Type: DEV; Supplier 1: Digi-Key; Supplier Part Number 1: F11451CT-ND
C12 = C0603C104K5RACTU: Multilayer Ceramic Capacitors (MLCC) - SMD/SMT 50volts 0.1uF X7R 10%; Manufacturer: KEMET; Voltage Rating (DC): 50V; Capacitance: 100nF; Dissipation Factor: 2.5%; Supplier 1: Digi-Key; Manufacturer Part Number: C0603C104K5RACTU; RoHS: Yes; Category: Ceramic Capacitors; Pricing 1: 1=0.12000, 10=0.08500, 50=0.04620, 100=0.03770, 500=0.02696, 1000=0.02118 (USD); Mount: Surface Mount; Case/Package: 0603; Number of Pins: 2; Case Code (Metric): 1608; Case Code (Imperial): 0603; Dielectric Material: Ceramic; Contact Plating: Tin,Matte; Min Operating Temperature: -55°C; Max Operating Temperature: 125°C; Tolerance: 10%; Voltage Rating: 50V; Packaging: Tape and Reel; Package Quantity: 1; Dielectric: X7R; Termination: SMD/SMT; Voltage: 50V; Series: SMD Comm X7R; Length: 0.063inch; Width: 0.031inch; Height: 0.8mm; Thickness: 0.034inch; Depth: 0.8mm; Lead Pitch: 0.7mm; Radiation Hardening: No; REACH SVHC: No SVHC; RoHS Compliant: Yes; ComponentLink1URL: https://datasheet.ciiva.com/7823/kem-c1002-x7r-smd-7823591.pdf?src-supplier=Element14; ComponentLink1Description: https://datasheet.ciiva.com/7823/kem-c1002-x7r-smd-7823591.pdf?src-supplier=Element14; ComponentLink2URL: https://datasheet.ciiva.com/7823/kem-c1002-x7r-smd-7823592.pdf?src-supplier=Element14; ComponentLink2Description: https://datasheet.ciiva.com/7823/kem-c1002-x7r-smd-7823592.pdf?src-supplier=Element14; ComponentLink3URL: https://datasheet.ciiva.com/5999/kem-c1002-x7r-smd-5999400.pdf?src-supplier=Farnell; ComponentLink3Description: https://datasheet.ciiva.com/5999/kem-c1002-x7r-smd-5999400.pdf?src-supplier=Farnell; ComponentLink4URL: https://datasheet.ciiva.com/28645/1851736-28645640.pdf?src-supplier=Element14; ComponentLink4Description: https://datasheet.ciiva.com/28645/1851736-28645640.pdf?src-supplier=Element14; ComponentLink5URL: https://datasheet.ciiva.com/14585/70095383-14585209.pdf?src-supplier=Allied+Electronics; ComponentLink5Description: https://datasheet.ciiva.com/14585/70095383-14585209.pdf?src-supplier=Allied+Electronics; ComponentLink6URL: https://datasheet.ciiva.com/14602/70095383-14602583.pdf?src-supplier=Allied+Electronics; ComponentLink6Description: https://datasheet.ciiva.com/14602/70095383-14602583.pdf?src-supplier=Allied+Electronics; Supplier Part Number 1: 399-C0603C104K5RAC7867CT-ND; Stock 1: 10133409
C20 = UUD1V4R7MCL1GS: Cap Aluminum Lytic 4.7uF 35V 20% (4 X 5.8mm) SMD 80mA 2000h 105C Automotive T/R; Manufacturer: Nichicon; Dielectric Material: Aluminium; Leakage Current: 3uA; Life (Hours): 2000Hour; Impedance: 1.8R; Dissipation Factor: 0.12%; Supplier 1: Digi-Key; Manufacturer Part Number: UUD1V4R7MCL1GS; RoHS: Yes; Category: Aluminum Electrolytic Capacitors; Pricing 1: 1=0.51000, 10=0.35600, 50=0.24960, 100=0.21390, 500=0.16042, 1000=0.13547 (USD); Case/Package: Radial; Number of Pins: 2; Min Operating Temperature: -55°C; Max Operating Temperature: 105°C; Tolerance: 20%; Ripple Current: 80mA; Package Quantity: 2000; Voltage Rating (DC): 35V; Packaging: Tape and Reel; Capacitance: 4.7uF; Termination: SMD/SMT; Series: UUD; Voltage Rating: 35V; Construction: Cylindrical; Ripple Current (AC): 80mA; Diameter: 4mm; Length: 5.8mm; Height: 5.8mm; Height - Seated (Max): 0.228inch; Radiation Hardening: No; RoHS Compliant: Yes; Lead Free: Lead Free; REACH SVHC: No SVHC; ComponentLink1URL: https://datasheet.ciiva.com/96/e-ud-96647.pdf?src-supplier=Digi-Key; ComponentLink1Description: https://datasheet.ciiva.com/96/e-ud-96647.pdf?src-supplier=Digi-Key; ComponentLink2URL: https://datasheet.ciiva.com/96/e-ud-96648.pdf?src-supplier=Digi-Key; ComponentLink2Description: https://datasheet.ciiva.com/96/e-ud-96648.pdf?src-supplier=Digi-Key; ComponentLink3URL: https://datasheet.ciiva.com/96/e-ud-96649.pdf?src-supplier=Digi-Key; ComponentLink3Description: https://datasheet.ciiva.com/96/e-ud-96649.pdf?src-supplier=Digi-Key; ComponentLink4URL: https://datasheet.ciiva.com/5360/e-ud-5360520.pdf?src-supplier=Mouser; ComponentLink4Description: https://datasheet.ciiva.com/5360/e-ud-5360520.pdf?src-supplier=Mouser; ComponentLink5URL: https://datasheet.ciiva.com/11687/e-ud-11687388.pdf?src-supplier=Avnet; ComponentLink5Description: https://datasheet.ciiva.com/11687/e-ud-11687388.pdf?src-supplier=Avnet; ComponentLink6URL: https://datasheet.ciiva.com/16383/e-ud-16383407.pdf?src-supplier=Future+Electronics; ComponentLink6Description: https://datasheet.ciiva.com/16383/e-ud-16383407.pdf?src-supplier=Future+Electronics; ComponentLink7URL: https://datasheet.ciiva.com/7793/e-ud-7793429.pdf?src-supplier=Element14; ComponentLink7Description: https://datasheet.ciiva.com/7793/e-ud-7793429.pdf?src-supplier=Element14; ComponentLink8URL: https://datasheet.ciiva.com/17354/e-ud-17354680.pdf?src-supplier=Avnet+Europe; ComponentLink8Description: https://datasheet.ciiva.com/17354/e-ud-17354680.pdf?src-supplier=Avnet+Europe; Supplier Part Number 1: 493-2281-1-ND; Stock 1: 5341
CF3 = GCM188R71C105KA64J: 0603 1 uF 16 V Â±10% Tolerance X7R Automotive Multilayer Ceramic Capacitor; MF: Murata; Value: *; Price: None; Package: 1608 Murata; Check_prices: https://www.snapeda.com/parts/GCM188R71C105KA64J/Murata%20Electronics%20North%20America/view-part/1755583/?ref=eda; Availability: In Stock; SnapEDA_Link: https://www.snapeda.com/parts/GCM188R71C105KA64J/Murata%20Electronics%20North%20America/view-part/1755583/?ref=snap; MP: GCM188R71C105KA64J; Supplier 1: Mouser; Supplier Part Number 1: 81-GCM188R71C105KA4J
F1 = 0ZCJ0005FF2E: Fuse; Manufacturer_Name: Bel Circuit Protection; Datasheet Link: https://www.belfuse.com/resources/datasheets/circuitprotection/ds-cp-0zcj-series.pdf; Height: 0.85mm; Manufacturer_Part_Number: 0ZCJ0005FF2E; Arrow Part Number: 0ZCJ0005FF2E; Arrow Price/Stock: https://www.arrow.com/en/products/0zcj0005ff2e/bel-group
RF2 = CRGS0805J100R: 100 Ohms Â±5% 0.5W, 1/2W Chip Resistor 0805 _2012 Metric_ Pulse Withstanding Thick Film; MF: TE Connectivity; TE_purchase_URL: https://www.te.com/usa-en/product-2-2176244-5.html?te_bu=Cor&te_type=disp&te_campaign=seda_glo_cor-seda-global-disp-prtnr-fy19-seda-model-bom-cta_sma-317_1&elqCampaignId=32493; Package: 0805 TE Connectivity; SnapEDA_Link: https://www.snapeda.com/parts/CRGS0805J100R/TE%20Connectivity%20AMP%20Connectors/view-part/1008227/?ref=snap; MP: CRGS0805J100R; Value: *; Availability: Unavailable; Price: None; Supplier 1: Mouser; Supplier Part Number 1: 279-CRGS0805J100R
U3 = LT1990ACS8PBF: SP Amp DIFF AMP Single R-R O/P ±18V/36V Automotive 8-Pin SOIC N Tube; Manufacturer: Analog Devices / Linear Technology; MF: Analog Devices; MP: LT1990ACS8#PBF; Bandwidth: 100kHz; Number of Channels: 1; Common Mode Rejection Ratio: 70dB; Min Dual Supply Voltage: 1.35V; Max Dual Supply Voltage: 18V; -3db Bandwidth: 105kHz; Slew Rate: 0.55V/µs; Max Supply Voltage: 36V; Min Supply Voltage: 2.4V; Input Offset Voltage (Vos): 5.2mV; Operating Supply Current: 140uA; Output Current per Channel: 22mA; Power Supply Rejection Ratio (PSRR): 80dB; Input Resistance: 2MR; Amplifier Type: DIFFERENTIAL; Price: None; Availability: Good; SnapEDA_Link: https://www.snapeda.com/parts/LT1990ACS8%23PBF/Analog%20Devices/view-part/4348994/?ref=snap; Package: SOIC -8 Analog Devices; Value: *; Purchase-URL: https://pricing.snapeda.com/search/part/LT1990ACS8#PBF/?ref=eda; Supplier 1: Mouser; Check_prices: h; Manufacturer Part Number: LT1990ACS8#PBF; RoHS: Yes; Category: Amplifiers - Op Amps, Buffer, Instrumentation; Stock 1: 55; Pricing 1: 1=5.20000, 10=4.67000, 50=4.42000, 100=3.82000, 1000=3.25000, 10000=3.25000 (USD); Case/Package: SOIC; Number of Pins: 8; Min Operating Temperature: 0°C; Max Operating Temperature: 70°C; Package Quantity: 100; Packaging: Rail/Tube; Nominal Gain Bandwidth Product: 100kHz; Number of Circuits: 1; Number of Amplifiers: 1; Number of Elements: 1; Radiation Hardening: No; REACH SVHC: No SVHC; Lead Free: Lead Free; RoHS Compliant: Yes; ComponentLink1URL: https://datasheet.ciiva.com/15128/getdatasheetpartid-371446-15128871.pdf?src-supplier=Verical; ComponentLink1Description: https://datasheet.ciiva.com/15128/getdatasheetpartid-371446-15128871.pdf?src-supplier=Verical; ComponentLink2URL: https://datasheet.ciiva.com/1802/5087-1802941.pdf?src-supplier=Digi-Key; ComponentLink2Description: https://datasheet.ciiva.com/1802/5087-1802941.pdf?src-supplier=Digi-Key; ComponentLink3URL: https://datasheet.ciiva.com/1492/1990fb-1492770.pdf?src-supplier=Farnell; ComponentLink3Description: https://datasheet.ciiva.com/1492/1990fb-1492770.pdf?src-supplier=Farnell; ComponentLink4URL: https://datasheet.ciiva.com/1485/1679607-1485298.pdf?src-supplier=Element14; ComponentLink4Description: https://datasheet.ciiva.com/1485/1679607-1485298.pdf?src-supplier=Element14
RF1 = CRS2010AFX-1001ELF: Package: None; Price: None; Value: *; MP: CRS2010AFX-1001ELF; Availability: Unavailable; Supplier 1: Digi-Key; Supplier Part Number 1: CRS2010AFX-1001ELFCT-ND

## Sheet 4-20mA_Inputs_(3-6).SchDoc
size A; SheetNumber: 9; SheetTotal: 16
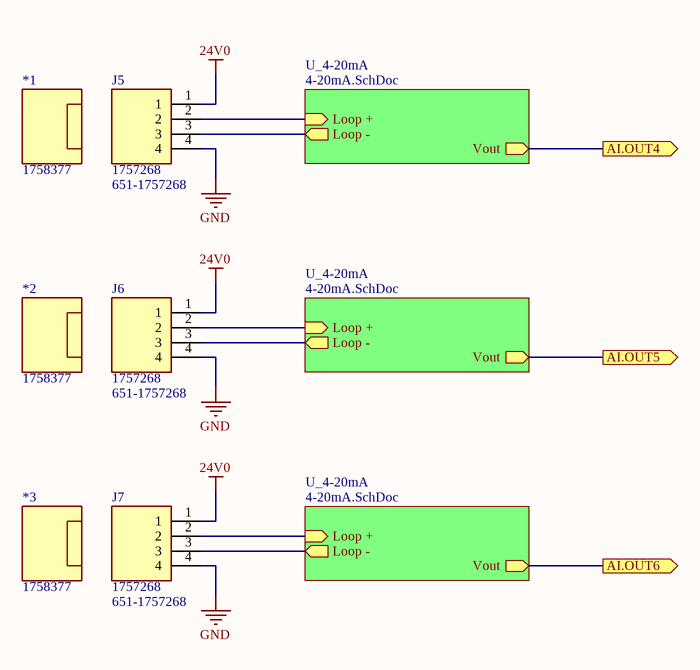
[diagram p7: 4-20mA_Inputs_(3-6).SchDoc]

### Parts
*1  1758377  [Connector_1758377]
*2  1758377  [Connector_1758377]
*3  1758377  [Connector_1758377]
J5  1757268  Supplier Part Number 1: 651-1757268  [SHDRRA4W103P0X508_1X4_2232X1200X875P]
J6  1757268  Supplier Part Number 1: 651-1757268  [SHDRRA4W103P0X508_1X4_2232X1200X875P]
J7  1757268  Supplier Part Number 1: 651-1757268  [SHDRRA4W103P0X508_1X4_2232X1200X875P]

### Sub-sheets
U_4-20mA = 4-20mA.SchDoc: Loop + (in), Loop - (out), Vout (out)
U_4-20mA = 4-20mA.SchDoc: Loop + (in), Loop - (out), Vout (out)
U_4-20mA = 4-20mA.SchDoc: Loop + (in), Loop - (out), Vout (out)

### Ports
AI.OUT4 (out), AI.OUT5 (out), AI.OUT6 (out)

### Nets
24V0: J5.1 J6.1 J7.1
GND: J5.4 J6.4 J7.4
Net_U_1_U_4-20mA_Inputs_(3-6)_U_4-20mA#1_2: J5.3 ; sheet U_4-20mA/Loop -
Net_U_1_U_4-20mA_Inputs_(3-6)_U_4-20mA#2_2: J6.3 ; sheet U_4-20mA/Loop -
Net_U_1_U_4-20mA_Inputs_(3-6)_U_4-20mA#3_2: J7.3 ; sheet U_4-20mA/Loop -
NetCF3_U_4-20mA_Inputs_(3-6)_U_4-20mA#1_1: port AI.OUT4, sheet U_4-20mA/Vout
NetCF3_U_4-20mA_Inputs_(3-6)_U_4-20mA#2_1: port AI.OUT5, sheet U_4-20mA/Vout
NetCF3_U_4-20mA_Inputs_(3-6)_U_4-20mA#3_1: port AI.OUT6, sheet U_4-20mA/Vout
NetF1_U_4-20mA_Inputs_(3-6)_U_4-20mA#1_1: J5.2 ; sheet U_4-20mA/Loop +
NetF1_U_4-20mA_Inputs_(3-6)_U_4-20mA#2_1: J6.2 ; sheet U_4-20mA/Loop +
NetF1_U_4-20mA_Inputs_(3-6)_U_4-20mA#3_1: J7.2 ; sheet U_4-20mA/Loop +

### Library data of the parts
*1-*3 = 1758377: as 1 on sheet 4-20mA_Inputs_(1-3); Supplier 1: Digi-Key; Manufacturer Part Number: 1758377; RoHS: Yes; Category: Terminal Blocks; Pricing 1: 1=4.53000, 10=4.33400, 50=4.21580, 100=3.94000, 250=3.62484, 500=3.34900, 1000=3.19143, 2500=3.03380 (USD); Mount: Free Hanging; Color: Green; Contact Plating: Tin; Weight: 0.249387oz; Housing Color: Green; Housing Material: Plastic; Package Quantity: 50; Packaging: Bulk; Current Rating: 12A; Termination: Screw; Number of Positions: 4; Number of Contacts: 4; Number of Poles: 4; Connector Type: Screw; Series: COMBICON MSTB; Flammability Rating: UL94 V-0; ComponentLink1URL: https://datasheet.ciiva.com/795/1758377-795513.pdf?src-supplier=Digi-Key; ComponentLink1Description: https://datasheet.ciiva.com/795/1758377-795513.pdf?src-supplier=Digi-Key; ComponentLink2URL: https://datasheet.ciiva.com/16046/1758377-16046392.pdf?src-supplier=Onlinecomponents.com; ComponentLink2Description: https://datasheet.ciiva.com/16046/1758377-16046392.pdf?src-supplier=Onlinecomponents.com; ComponentLink3URL: https://datasheet.ciiva.com/29376/567557-da-01-de-steckerteil-1758377-50-st-29376878.pdf?src-supplier=Conrad; ComponentLink3Description: https://datasheet.ciiva.com/29376/567557-da-01-de-steckerteil-1758377-50-st-29376878.pdf?src-supplier=Conrad; ComponentLink4URL: https://datasheet.ciiva.com/14607/70055302-14607548.pdf?src-supplier=Allied+Electronics; ComponentLink4Description: https://datasheet.ciiva.com/14607/70055302-14607548.pdf?src-supplier=Allied+Electronics; ComponentLink5URL: https://datasheet.ciiva.com/33106/1758377-33106027.pdf?src-supplier=Today+Components; ComponentLink5Description: https://datasheet.ciiva.com/33106/1758377-33106027.pdf?src-supplier=Today+Components; Supplier Part Number 1: 277-1966-ND; Stock 1: 560
J5-J7 = 1757268: as J2 on sheet 4-20mA_Inputs_(1-3); Datasheet Link: https://datasheet.datasheetarchive.com/originals/distributors/SFDatasheet-2/sf-00051651.pdf; Height: 8.75mm; Manufacturer_Part_Number: 1757268; Mouser Part Number: 651-1757268; Mouser Price/Stock: https://www.mouser.co.uk/ProductDetail/Phoenix-Contact/1757268?qs=uD%2FdkN7XIa2BicmSj3mD7g%3D%3D; Arrow Part Number: 1757268; Arrow Price/Stock: https://www.arrow.com/en/products/1757268/phoenix-contact?region=nac; Supplier 1: Mouser